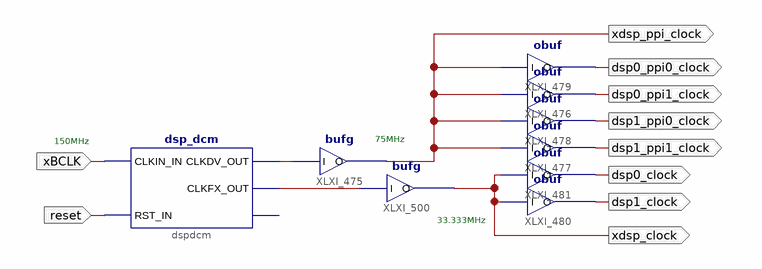
[diagram p0: schematic sheet 1]
// Xilinx ISE schematic dsp_clocks.sch (virtex4) as structural Verilog: 9 symbols, 10 ports
module dsp_clocks (
  input  xBCLK,
  input  reset,
  output dsp1_ppi1_clock,
  output dsp1_ppi0_clock,
  output dsp0_ppi1_clock,
  output dsp0_ppi0_clock,
  output dsp0_clock,
  output dsp1_clock,
  output xdsp_clock,
  output xdsp_ppi_clock
);

  wire XLXN_602, XLXN_651;

  obuf XLXI_479 (.I(xdsp_ppi_clock), .O(dsp0_ppi0_clock));
  obuf XLXI_478 (.I(xdsp_ppi_clock), .O(dsp1_ppi0_clock));
  obuf XLXI_477 (.I(xdsp_ppi_clock), .O(dsp1_ppi1_clock));
  obuf XLXI_476 (.I(xdsp_ppi_clock), .O(dsp0_ppi1_clock));
  obuf XLXI_480 (.I(xdsp_clock), .O(dsp1_clock));
  obuf XLXI_481 (.I(xdsp_clock), .O(dsp0_clock));
  bufg XLXI_500 (.I(XLXN_602), .O(xdsp_clock));
  bufg XLXI_475 (.I(XLXN_651), .O(xdsp_ppi_clock));
  dsp_dcm dspdcm (.CLKDV_OUT(XLXN_651), .CLKFX_OUT(XLXN_602), .CLKIN_IN(xBCLK), .RST_IN(reset));  // open: CLK0_OUT

  // Notes on the sheet:
  //   75MHz
  //   150MHz
  //   33.333MHz
endmodule
